# EAGLE design board1 (EAGLE 9.6.2)
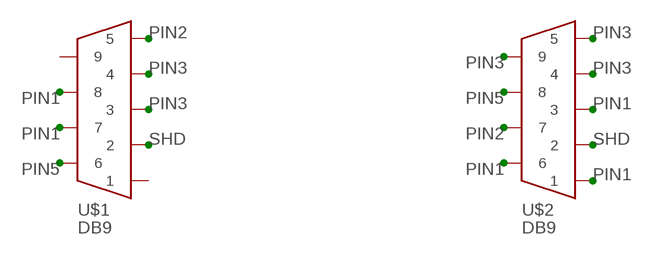
[diagram p0: schematic, sheet 1]

## Parts
U$1  DB9  [DB9]
U$2  DB9  [DB9]

## Nets
PIN1: U$1.7 U$1.8 U$2.1 U$2.3 U$2.6
PIN2: U$1.5 U$2.7
PIN3: U$1.3 U$1.4 U$2.4 U$2.5 U$2.9
PIN5: U$1.6 U$2.8
SHD: U$1.2 U$2.2
Unconnected: U$1.1 U$1.9

## Library data of the parts
U$1 U$2 = My Library:DB9

## Board
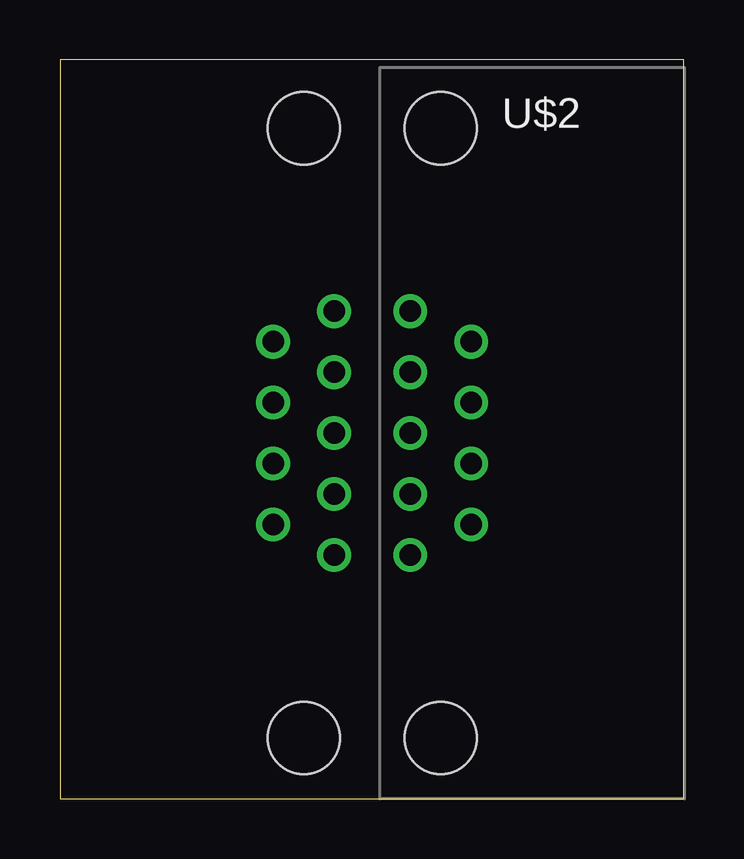
[diagram p1: board, top side]
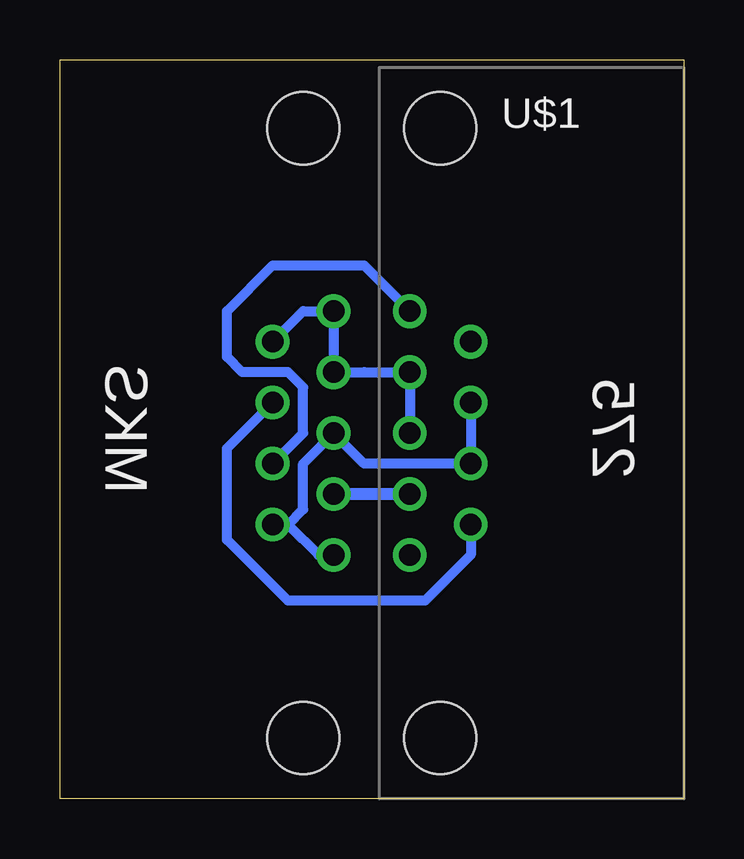
[diagram p2: board, bottom side, seen from below]

Size 26.02 x 30.79 mm. Coordinates in mm from the lower left corner, seen from the top.
Outline: 0,0 26.02,0 26.02,30.79 0,30.79 0,0
Copper layers (1*16): Top 0.035mm / dielectric 1.5mm / Bottom 0.035mm
Design rules "DRC_Advanced": minimum track width 12mil, minimum drill 0.3mm, track to track 12mil, track to pad 12mil, pad to pad 12mil, via to via 12mil, smd to smd 6mil, copper to edge 12mil, drill to drill 12mil, minimum pad ring 10mil, minimum via ring 8mil, stop-mask expansion 4mil, vias tented up to drill 0mil, thermal gap 20mil

### Footprints (pad centres in the part's own frame; a part is rotated, then mirrored left to right if it is on the bottom)
DB9 = drill 0.9: 1 1.27,10.16; 2 1.27,12.7; 3 1.27,15.24; 4 1.27,17.78; 5 1.27,20.32; 6 3.81,11.43; 7 3.81,13.97; 8 3.81,16.51; 9 3.81,19.05 | hole 3.01: 2.54,27.94; 2.54,2.54

### Placement (x,y rotation side)
U$1  12.7,0 0 bottom
U$2  13.34,0 0 top

### Tracks (layer width: path | path; a pad name or v marks a point on that pad's centre or on a via)
PIN1
  Bottom 0.406: U$2.1 15.24,10.16 16.51,11.43 | 16.51,11.43 U$2.6 | U$1.8 U$1.7 13.34,13.97 U$2.3 15.88,13.97 15.88,12.06 16.51,11.43
PIN2
  Bottom 0.406: U$1.5 13.34,22.23 17.14,22.23 19.05,20.32 19.05,18.41 18.41,17.78 16.51,17.78 15.88,17.14 15.88,15.24 U$2.7
PIN3
  Bottom 0.406: U$2.9 15.88,20.32 U$2.5 U$2.4 13.34,17.78 U$1.4 U$1.3
PIN5
  Bottom 0.406: U$1.6 8.89,10.16 10.79,8.26 16.51,8.26 19.05,10.79 19.05,14.61 U$2.8
SHD
  Bottom 0.508: U$1.2 U$2.2

### Text on the board
bNames: 275 | MKS